# Altium schematic sheet FPGA_Digilent_XC9500_DigiLab_XC95.SchDoc
size A; Organization: Altium Limited; Address1: L3, 12a Rodborough Rd; Address2: Frenchs Forest; Address3: NSW; Address4: Australia 2086; DocumentNumber: 1; SheetNumber: 1; SheetTotal: 2
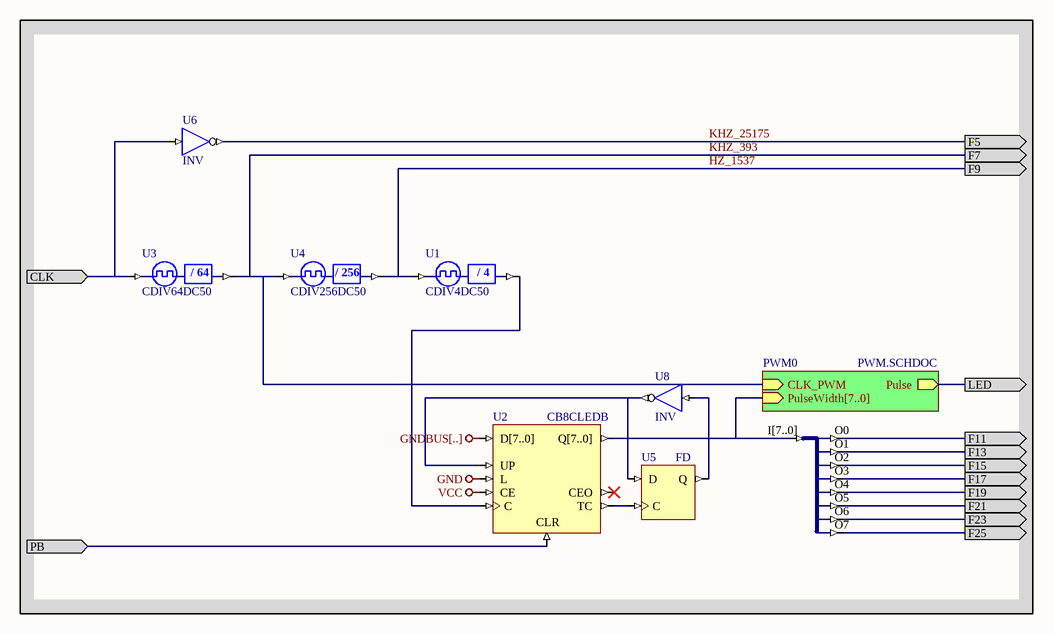
[diagram p0: FPGA_Digilent_XC9500_DigiLab_XC95.SchDoc]

## Parts
U1  CDIV4DC50
U2  CB8CLEDB
U3  CDIV64DC50
U4  CDIV256DC50
U5  FD
U6  INV
U7  J8B_8S  (value not drawn)
U8  INV

## Sub-sheets
PWM0 = PWM.SCHDOC: Pulse (out), CLK_PWM (in), PulseWidth[7..0] (in)

## Ports
CLK (in), F5 (out), F7 (out), F9 (out), F11 (out), F13 (out), F15 (out), F17 (out), F19 (out), F21 (out), F23 (out), F25 (out), LED (out), PB (in)

## Nets
GND: U2.L
GNDBUS[..]: U2.D[7..0]
VCC: U2.CE
CLK: U3.CLKIN U6.I ; port CLK
F11: U7.O0 ; port F11
F13: U7.O1 ; port F13
F15: U7.O2 ; port F15
F17: U7.O3 ; port F17
F19: U7.O4 ; port F19
F21: U7.O5 ; port F21
F23: U7.O6 ; port F23
F25: U7.O7 ; port F25
HZ_1537: U1.CLKIN U4.CLKDV ; port F9
KHZ_393: U3.CLKDV U4.CLKIN ; port F7, sheet PWM0/CLK_PWM
KHZ_25175: U6.O ; port F5
LED: port LED, sheet PWM0/Pulse
PB: U2.CLR ; port PB
NetU1_CLKDV: U1.CLKDV U2.C
NetU2_Q[7..0]: U2.Q[7..0] U7.I[7..0] ; sheet PWM0/PulseWidth[7..0]
NetU2_TC: U2.TC U5.C
NetU2_UP: U2.UP U5.D U8.O
NetU5_Q: U5.Q U8.I

Not connected (* = marked no-connect by the designer): U2 CEO*

## Notes on the sheet
- Title
- Size:
- Date:
- A
- Number:
- Time:
- Revision:
- Sheet
- of
- File:
- (in symbol CDIV4DC50) / 4
- (in symbol CDIV64DC50) / 64
- (in symbol CDIV256DC50) / 256

## Library data of the parts
U1 = CDIV4DC50: Clock Divider by 4 with 50% Duty Cycle Output; ArchiveName: GENERIC; Xilinx Equivalent: CLK_DIV4; Published: 18-Dec-2003; Publisher: Altium Limited; Core Revision: 1.00.00
U2 = CB8CLEDB: 8-Bit Loadable Cascadable Bidirectional Binary Counter with Clock Enable and Asynchronous Clear, Bus Version; ArchiveName: GENERIC; Published: 18-Dec-2003; Publisher: Altium Limited; Core Revision: 1.00.00; Xilinx Equivalent: CB8CLED
U3 = CDIV64DC50: Clock Divider by 64 with 50% Duty Cycle Output; ArchiveName: GENERIC; Published: 18-Dec-2003; Publisher: Altium Limited; Core Revision: 1.00.00
U4 = CDIV256DC50: Clock Divider by 256 with 50% Duty Cycle Output; ArchiveName: GENERIC; Published: 18-Dec-2003; Publisher: Altium Limited; Core Revision: 1.00.00
U5 = FD: D-Type Flip-Flop; ArchiveName: GENERIC; Published: 18-Dec-2003; Publisher: Altium Limited; Xilinx Equivalent: FD; Core Revision: 1.00.00
U6 U8 = INV: Inverter; ArchiveName: GENERIC; Published: 18-Dec-2003; Publisher: Altium Limited; Xilinx Equivalent: INV; Core Revision: 1.00.00
U7 = J8B_8S: 8-Bit input bus to 8 single pin outputs; ArchiveName: GENERIC; Published: 18-Dec-2003; Publisher: Altium Limited; Core Revision: 1.00.00